# Altium schematic sheet Sheet2.SchDoc
size A4
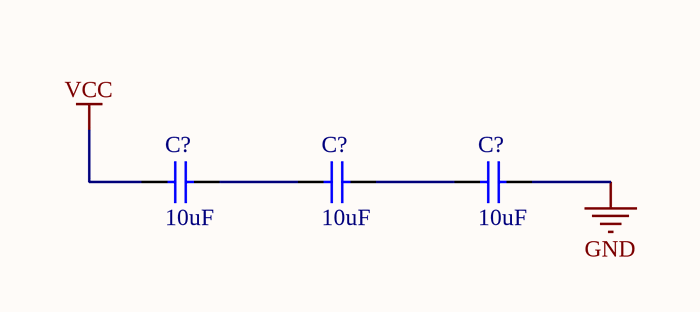
[diagram p0: Sheet2.SchDoc]

## Parts
(Parts that share a designator on the sheet are numbered #1, #2 ... from top to bottom, then left to right.)
C?#1  value 10uF  [0603_C_M]  (hidden comment: C_Semi)
C?#2  value 10uF  [0603_C_M]  (hidden comment: C_Semi)
C?#3  value 10uF  [0603_C_M]  (hidden comment: C_Semi)

## Nets
GND: C?#3.1
VCC: C?#1.2
NetC?#1_1: C?#1.1 C?#2.2
NetC?#2_1: C?#2.1 C?#3.2

## Library data of the parts
C?#1-C?#3 = C_Semi: Capacitor (Semiconductor SIM Model); System Sch Lib Author: Akilan G; Publisher: Grinntech Motors & Services; DNP: *; AEC-Q100: *; ComponentLink1URL: *; Manufacturer: *; MountType: *; Mouser PartNumber: *; Mfr PartNumber: *; Digikey PartNumber: *; ROHS: *; User Sch Lib Author: *; Voltage: *; Thermal Rating: *; Tolerance: *; Terminal Type: *; ComponentLink1Description: DatasheetLink